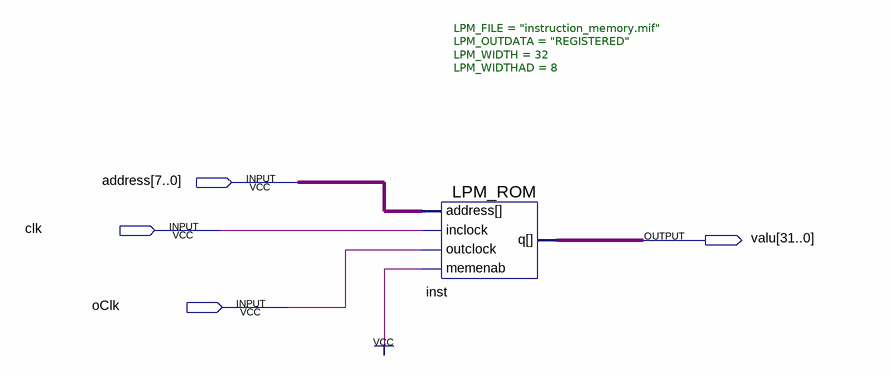
[diagram p0: schematic sheet]
// Quartus schematic instructionMem.bdf as structural Verilog: 1 symbols, 4 pins
module instructionMem (
  input  [7:0] address,
  input  clk,
  input  oClk,
  output [31:0] valu
);

  LPM_ROM #(.LPM_FILE("instruction_memory.mif"), .LPM_OUTDATA("REGISTERED"), .LPM_WIDTH(32), .LPM_WIDTHAD(8)) inst (
    .address(address), .inclock(clk), .outclock(oClk), .memenab(1'b1), .q(valu));
endmodule
